# Altium schematic sheet MT29 - 2GBiT Parallel.SchDoc
size A4; SheetNumber: 1; SheetTotal: 1
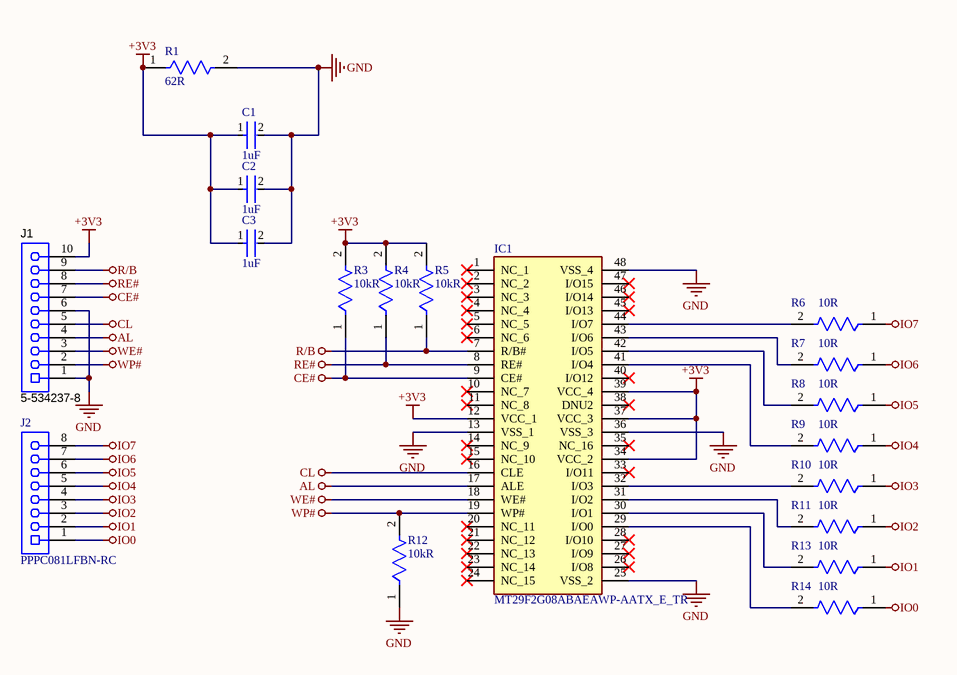
[diagram p0: MT29 - 2GBiT Parallel.SchDoc]

## Parts
C1  1uF  [FP-GCM188-0_1-IPC_B]
C2  1uF  [FP-GCM188-0_1-IPC_B]
C3  1uF  [FP-GCM188-0_1-IPC_B]
IC1  MT29F2G08ABAEAWP-AATX_E_TR  [SOP50P2000X120-48N]
J1  5-534237-8  [TECO-5-534237-8_V]
J2  PPPC081LFBN-RC  [SLIN-PPPC081LFBN-RC_V]
R1  62R  [FP-AC0603-IPC_A]
R3  10kR  [FP-AC0603-IPC_B]
R4  10kR  [FP-AC0603-IPC_B]
R5  10kR  [FP-AC0603-IPC_B]
R6  10R  [FP-AC0603-MFG]
R7  10R  [FP-AC0603-MFG]
R8  10R  [FP-AC0603-MFG]
R9  10R  [FP-AC0603-MFG]
R10  10R  [FP-AC0603-MFG]
R11  10R  [FP-AC0603-MFG]
R12  10kR  [FP-AC0603-IPC_B]
R13  10R  [FP-AC0603-MFG]
R14  10R  [FP-AC0603-MFG]

## Nets
+3V3: C1.1 C2.1 C3.1 IC1.12(VCC_1) IC1.34(VCC_2) IC1.37(VCC_3) IC1.39(VCC_4) J1.10 R1.1 R3.2 R4.2 R5.2
AL: IC1.17(ALE) J1.4
CE#: IC1.9(CE#) J1.7 R3.1
CL: IC1.16(CLE) J1.5
GND: C1.2 C2.2 C3.2 IC1.13(VSS_1) IC1.25(VSS_2) IC1.36(VSS_3) IC1.48(VSS_4) J1.1 J1.6 R1.2 R12.1
IO0: J2.1 R14.1
IO1: J2.2 R13.1
IO2: J2.3 R11.1
IO3: J2.4 R10.1
IO4: J2.5 R9.1
IO5: J2.6 R8.1
IO6: J2.7 R7.1
IO7: J2.8 R6.1
R/B: IC1.7(R/B#) J1.9 R5.1
RE#: IC1.8(RE#) J1.8 R4.1
WE#: IC1.18(WE#) J1.3
WP#: IC1.19(WP#) J1.2 R12.2
NetIC1_29: IC1.29(I/O0) R14.2
NetIC1_30: IC1.30(I/O1) R13.2
NetIC1_31: IC1.31(I/O2) R11.2
NetIC1_32: IC1.32(I/O3) R10.2
NetIC1_41: IC1.41(I/O4) R9.2
NetIC1_42: IC1.42(I/O5) R8.2
NetIC1_43: IC1.43(I/O6) R7.2
NetIC1_44: IC1.44(I/O7) R6.2

Not connected (* = marked no-connect by the designer): IC1 1(NC_1)* 2(NC_2)* 3(NC_3)* 4(NC_4)* 5(NC_5)* 6(NC_6)* 10(NC_7)* 11(NC_8)* 14(NC_9)* 15(NC_10)* 20(NC_11)* 21(NC_12)* 22(NC_13)* 23(NC_14)* 24(NC_15)* 26(I/O8)* 27(I/O9)* 28(I/O10)* 33(I/O11)* 35(NC_16)* 38(DNU2)* 40(I/O12)* 45(I/O13)* 46(I/O14)* 47(I/O15)*

## Library data of the parts
C1-C3 = CMP-2006-02357-2: Ceramic Capacitor for Automotive 1uF  ±10% 16VDC X7R 0603 Paper T/R; Voltage: 16V; Thickness: 0.035inch; Width: 0.031inch; Radiation Hardening: No; Depth: 0.8mm; Max Operating Temperature: 125°C; Package Quantity: 1; Ratings: AEC-Q200; Min Operating Temperature: -55°C; Packaging: Tape and Reel; Case Code (Metric): 1608; REACH SVHC: No SVHC; Dielectric: X7R; Case Code (Imperial): 0603; Length: 1.6mm; Height: 0.8mm; Voltage Rating: 16V; Termination: SMD/SMT; Case/Package: 0603; Voltage Rating (DC): 16V; Tolerance: 10%; Capacitance: 1uF; Mount: Surface Mount; Lead Free: Lead Free
IC1 = MT29F2G08ABAEAWP-AATX_E_TR: Integrated Circuit; Manufacturer_Name: Micron; Manufacturer_Part_Number: MT29F2G08ABAEAWP-AATX:E TR; Datasheet Link: https://au.mouser.com/datasheet/2/671/MICT_S_A0003602039_1-2574397.pdf; Height: 1.2mm; Mouser Part Number: 340-278557-REEL; Mouser Price/Stock: https://www.mouser.co.uk/ProductDetail/Micron/MT29F2G08ABAEAWP-AATXE-TR?qs=j%252B1pi9TdxUaMl26HJ%252Bo32A%3D%3D; Arrow Part Number: MT29F2G08ABAEAWP-AATX:E TR; Arrow Price/Stock: https://www.arrow.com/en/products/mt29f2g08abaeawp-aatxetr/micron-technology
J1 = CMP-002-00019-2: Female Receptacle, Pitch 2.54 mm, 1 x 10 Position, Height 8.64 mm, Tail Length 2.92 mm, -65 to 105 degC, RoHS, Tube; Manufacturer: TE Connectivity; Max Contact Resistance: 12mohm; Connector Type: Header; Current Rating: 2A; Voltage Rating: 750V; Rows: 1; Datasheet Version: Apr-13; Contact Plating: Gold; Min Operating Temperature: -65°C; Manufacturer URL: http://www.te.com/; Mounting Technology: TH; Contact Material: Bronze; RoHS Compliant: True; Packaging: Rail/Tube; Contact Finish: Gold; Pins: 10; Case/Package: 5-534237-8; Max Operating Temperature: 105°C; Lead Pitch: 2.54mm; Gender: Female; Package Quantity: 22; Colour: Black; Package Description: Female Receptacle, Pitch 2.54 mm, 1 x 10 Position, Height 8.64 mm, Tail Length 2.92 mm; Package Reference: 5-534237-8; Datasheet URL: http://www.te.com/commerce/DocumentDelivery/DDEController?Action=showdoc&DocId=Customer+Drawing%7F534237%7FR5%7Fpdf%7FEnglish%7FENG_CD_534237_R5.pdf%7F5-534237-8
J2 = CMP-002-00028-2: Female Header, Pitch 2.54 mm, 1 x 8 Position, Height 8.5 mm, Tail Length 3.2 mm, -40 to 105 degC, RoHS, Bulk; Manufacturer: Sullins; Package Reference: PPPC081LFBN-RC; Connector Type: Header; Datasheet Version: Jan-15; Package Description: Female Header, Pitch 2.54 mm, 1 x 8 Position, Height 8.5 mm, Tail Length 3.2 mm; RoHS Compliant: Unknown; Max Operating Temperature: 105°C; Case/Package: PPPC081LFBN-RC; Min Operating Temperature: -40°C; Datasheet URL: http://sullinscorp.com/catalogs/101_PAGE114-115_.100_FEMALE_HDR.pdf; Gender: Female; Mounting Technology: TH
R1 = CMP-03412-023553-2: RES 62Ω 1.00% 0.1W 0603; Max Power Dissipation: 100mW; Temperature Coefficient: 100ppm/°C; Voltage Rating: 50V; Tolerance: 1%; Resistance: 62R; Height: 0.022inch; Length: 0.063inch; Features: Moisture Resistant; Case/Package: 0603; Series: AC; Min Operating Temperature: -55°C; Termination: SMD/SMT; RoHS Compliant: Yes; Width: 0.8mm; Max Operating Temperature: 155°C; Power Rating: 100mW; Lead Free: Lead Free; Number of Terminations: 2; Packaging: Tape and Reel; Case Code (Imperial): 0603; Case Code (Metric): 1608; Resistor Type: Thick Film
R3-R5 R12 = CMP-03412-028406-2: RES 910KΩ 1.00% 0.1W 0603; Voltage Rating: 50V; Power Rating: 100mW; Tolerance: 1%; Temperature Coefficient: 100ppm/°C; Resistance: 910kR; Max Operating Temperature: 155°C; Resistor Type: Thick Film; Case Code (Metric): 1608; Number of Terminations: 2; Case/Package: 0603; Packaging: Tape and Reel; Length: 0.063inch; Width: 0.8mm; Case Code (Imperial): 0603; Series: AC; RoHS Compliant: Yes; Termination: SMD/SMT; Min Operating Temperature: -55°C; Max Power Dissipation: 100mW; Features: Moisture Resistant; Height: 0.022inch
R6-R11 R13 R14 = CMP-2000-04819-3: RES 10Ω 1.00% 0.1W 0603; Tolerance: 1%; Voltage Rating: 50V; Power Rating: 100mW; Working Voltage: 75V; Temperature Coefficient: 200ppm/°C; Case/Package: 0603; Length: 0.063inch; Technology: THICK FILM; Features: Moisture Resistant; Moisture Sensitivity Level: 1; RoHS Compliant: Yes; Number of Terminations: 2; Min Operating Temperature: -55°C; Series: AC; Package Quantity: 1; Height: 0.022inch; Case Code (Metric): 1608; Termination: SMD/SMT; Packaging: Tape and Reel; Max Operating Temperature: 155°C; Width: 0.031inch; Resistor Type: Thick Film; Max Power Dissipation: 100mW; Resistance: 10R; Case Code (Imperial): 0603; Lead Free: Lead Free